# Altium project Second_PCB_Panel.PrjPcb
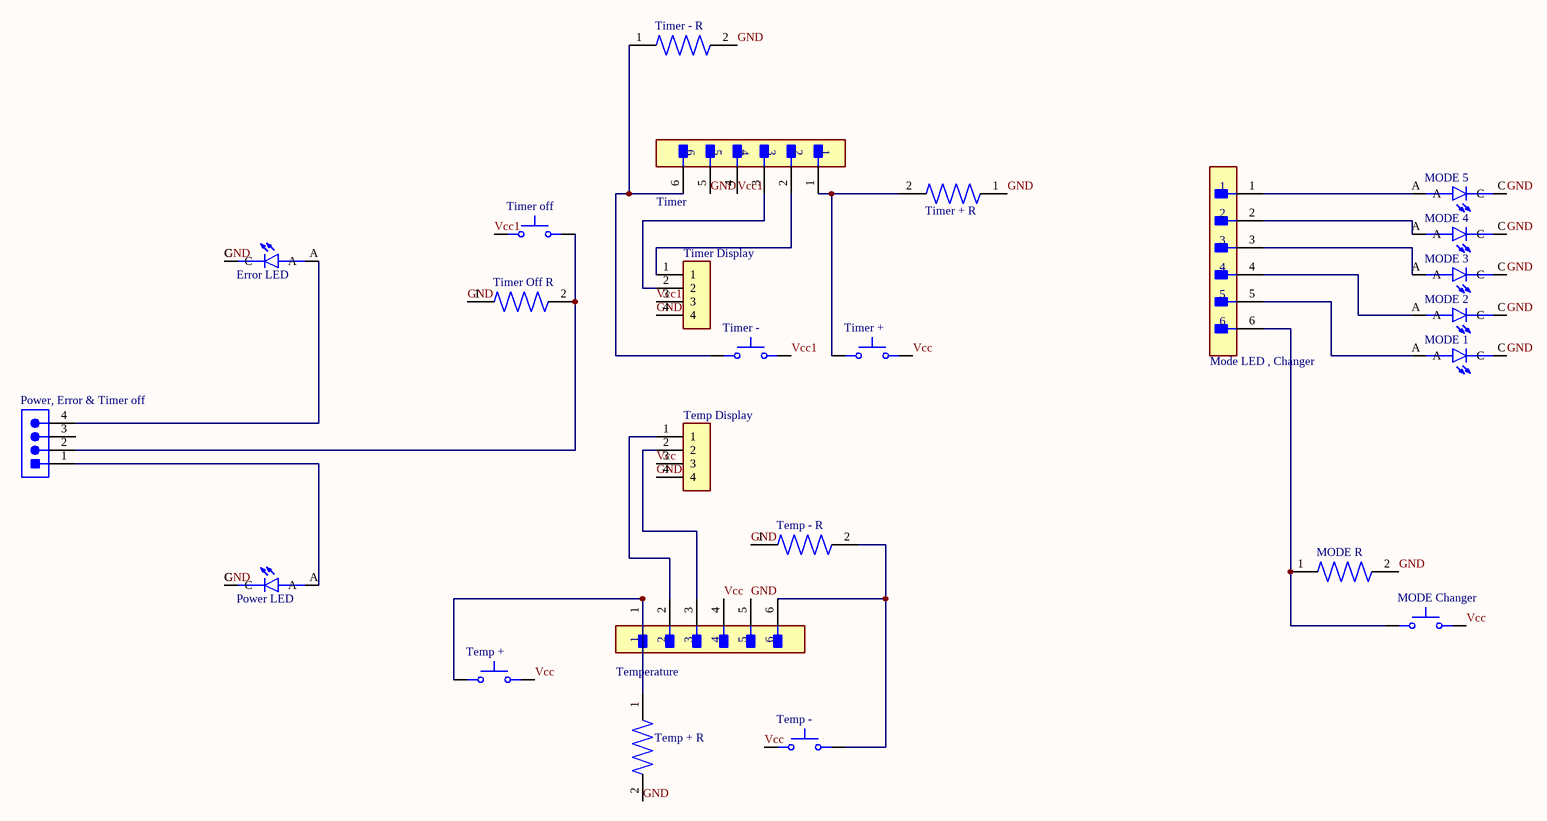
[diagram p0: Second_PCB.SchDoc]
1 sheet, 25 parts. Net scope: global (net labels, ports and power ports of the same name join across sheets).
Board file: Second_PCB.PcbDoc

## Sheet Second_PCB.SchDoc
size 381 x 241 mm; SheetNumber: 1; SheetTotal: 1

### Parts
Error_LED  WP7113SEC/J3  [LED_WP7113SEC/J3]  (value not drawn)
MODE_1  WP7113SEC/J3  [LED_WP7113SEC/J3]  (value not drawn)
MODE_2  WP7113SEC/J3  [LED_WP7113SEC/J3]  (value not drawn)
MODE_3  WP7113SEC/J3  [LED_WP7113SEC/J3]  (value not drawn)
MODE_4  WP7113SEC/J3  [LED_WP7113SEC/J3]  (value not drawn)
MODE_5  WP7113SEC/J3  [LED_WP7113SEC/J3]  (value not drawn)
MODE_Changer  800AWSP9M2QE  [SW_800AWSP9M2QE]  (value not drawn)
Mode_LED_,_Changer  22-28-4060  [FP-22-28-4060-MFG]  (value not drawn)
MODE_R  1623928-4  [RESAD700W45L350D185]  (value not drawn)
Power,_Error_&_Timer_off  640456-4  [TECO-640456-4]  (value not drawn)
Power_LED  WP7113SEC/J3  [LED_WP7113SEC/J3]  (value not drawn)
Temp_+  800AWSP9M2QE  [SW_800AWSP9M2QE]  (value not drawn)
Temp_+_R  1623928-4  [RESAD700W45L350D185]  (value not drawn)
Temp_-  800AWSP9M2QE  [SW_800AWSP9M2QE]  (value not drawn)
Temp_-_R  1623928-4  [RESAD700W45L350D185]  (value not drawn)
Temp_Display  2-826926-0  [TE_2-826926-0]  (value not drawn)
Temperature  22-28-4060  [FP-22-28-4060-MFG]  (value not drawn)
Timer  22-28-4060  [FP-22-28-4060-MFG]  (value not drawn)
Timer_+  800AWSP9M2QE  [SW_800AWSP9M2QE]  (value not drawn)
Timer_+_R  1623928-4  [RESAD700W45L350D185]  (value not drawn)
Timer_-  800AWSP9M2QE  [SW_800AWSP9M2QE]  (value not drawn)
Timer_-_R  1623928-4  [RESAD700W45L350D185]  (value not drawn)
Timer_Display  2-826926-0  [TE_2-826926-0]  (value not drawn)
Timer_off  800AWSP9M2QE  [SW_800AWSP9M2QE]  (value not drawn)
Timer_Off_R  1623928-4  [RESAD700W45L350D185]  (value not drawn)

### Nets
GND: Error_LED.C MODE_1.C MODE_2.C MODE_3.C MODE_4.C MODE_5.C MODE_R.2 Power_LED.C Temp_+_R.2 Temp_-_R.1 Temp_Display.4 Temperature.5 Timer.5 Timer_+_R.1 Timer_-_R.2 Timer_Display.4 Timer_Off_R.1
Vcc: MODE_Changer.3 Temp_+.3 Temp_-.1 Temp_Display.3 Temperature.4 Timer_+.3
Vcc1: Timer.4 Timer_-.3 Timer_Display.3 Timer_off.1
NetError_LED_A: Error_LED.A Power,_Error_&_Timer_off.4
NetMODE_1_A: MODE_1.A Mode_LED_,_Changer.5
NetMODE_2_A: MODE_2.A Mode_LED_,_Changer.4
NetMODE_3_A: MODE_3.A Mode_LED_,_Changer.3
NetMODE_4_A: MODE_4.A Mode_LED_,_Changer.2
NetMODE_5_A: MODE_5.A Mode_LED_,_Changer.1
NetMODE_Changer_1: MODE_Changer.1 Mode_LED_,_Changer.6 MODE_R.1
NetPower,_Error_&_Timer_off_1: Power,_Error_&_Timer_off.1 Power_LED.A
NetPower,_Error_&_Timer_off_2: Power,_Error_&_Timer_off.2 Timer_off.3 Timer_Off_R.2
NetTemp_+_1: Temp_+.1 Temp_+_R.1 Temperature.1
NetTemp_-_3: Temp_-.3 Temp_-_R.2 Temperature.6
NetTemp_Display_1: Temp_Display.1 Temperature.2
NetTemp_Display_2: Temp_Display.2 Temperature.3
NetTimer_1: Timer.1 Timer_+.1 Timer_+_R.2
NetTimer_2: Timer.2 Timer_Display.1
NetTimer_3: Timer.3 Timer_Display.2
NetTimer_6: Timer.6 Timer_-.1 Timer_-_R.1

Not connected (* = marked no-connect by the designer): Power,_Error_&_Timer_off 3

### Library data of the parts
Error_LED MODE_1-MODE_5 Power_LED = WP7113SEC/J3: Red 625nm LED Indication - Discrete 2.2V Radial; MF: Kingbright; Package: Radial Kingbright; Value: *; Availability: Unavailable; SnapEDA_Link: https://www.snapeda.com/parts/WP7113SEC/J3/Kingbright/view-part/826989/?ref=snap; Price: None; MP: WP7113SEC/J3
MODE_Changer Temp_+ Temp_- Timer_+ Timer_- Timer_off = 800AWSP9M2QE: Pushbutton Switch SPST-NO Standard Through Hole; MF: E-Switch; Availability: In Stock; SnapEDA_Link: https://www.snapeda.com/parts/800AWSP9M2QE/E-Switch/view-part/?ref=snap; Check_prices: https://www.snapeda.com/parts/800AWSP9M2QE/E-Switch/view-part/?ref=eda; Price: None; Package: None; Purchase-URL: https://pricing.snapeda.com/search/part/800AWSP9M2QE/?ref=eda; MP: 800AWSP9M2QE; Value: *
Mode_LED_,_Changer Temperature Timer = CMP-04776-000763-1: CONN HEADER VERT 6POS 2.54MM; Voltage Rating: 250V; Current Rating: 4A; Number of Contacts: 6; Max Voltage Rating (DC): 250.25kV; Gender: Male; Contact Resistance: 20mR; Connector Type: Male Pin; Color: Black; Max Voltage Rating (AC): 250V; Pitch: 2.54mm; Orientation: Straight; Max Operating Temperature: 75°C; Contact Plating: Tin; Depth: 2.49mm; Contact Type: Male Pin; Number of Positions: 6; Length: 15.24mm; Packaging: Bulk; Mount: Through Hole; Housing Material: Thermoplastic; Housing Color: Black; Termination: Solder; Contact Material: Brass; Min Operating Temperature: 0°C; Series: KK® 42375; Number of Rows: 1; Package Quantity: 1; RoHS Compliant: Yes; Contact Mating Length: 0.24inch
MODE_R Temp_+_R Temp_-_R Timer_+_R Timer_-_R Timer_Off_R = 1623928-4: CFR16 5% 10K; Package: None; Price: None; Value: *; MP: 1623928-4; Availability: Unavailable
Power,_Error_&_Timer_off = CMP-2000-05419-1: Male Header, Pitch 2.54 mm, 1 x 4 Position, Height 10.03 mm, Tail Length 3.56 mm, RoHS, Bulk; Manufacturer: TE Connectivity; Material, Housing: Polyester; Primary Type: InterconnectSystem; Mount Angle: Vertical; Color, Housing: White; Current, Rating: 5 / A; Agency Approvals: CSA,UL; Contact Termination Area Plating: Tin; Temperature, Operating: -55to+105 / degC; Standards: RoHSCompliant,ELVCompliant,UL94V-0; Number of Positions: 4; Brand/Series: MTA-100Series; Angle: Straight; Pin Spacing: 0.1 / "; Material, Contact: CopperAlloy; Connector Type: MTA-100; Special Features: Pinstrip; Mounting Hole Size: 0.04 / "; Contact Centerline Spacing: 0.100 / in.; Voltage, Rating: 250 / V; Manufacturer URL: http://www.te.com/; Length, Pin: 0.14 / "; Length, Overall: 0.4 / "; Color: White; Flammability Rating: UL94V-0; Mounting Type: PCMount; Termination: Solder; Datasheet URL: https://datasheet.ciiva.com/16286/eng-ds-82056-mta-0608-16286228.pdf; Number of Contacts: 4; Contact Shape: Square; Contact Mating Area Plating: Tin; Length, Terminal Post: 0.14 / in.; Size, Post: 0.025 / in.; Contact Plating: Tin; Type: PCBPlug; Datasheet Version: Dec-14; Number of Rows: 1
Temp_Display Timer_Display = 2-826926-0: 20P AMPMODU II PIN HDR; Centerline_Pitch: 2.54 mm[.1 in]; MF: TE Connectivity; Number_of_Positions: 20; Product_Type: Connector; Availability: Warning; EU_RoHS_Compliance: Compliant; Price: None; Value: *; MP: 2-826926-0; Package: None; SnapEDA_Link: https://www.snapeda.com/parts/2-826926-0/TE%20Connectivity%20AMP%20Connectors/view-part/1399270/?ref=snap